# EAGLE board VC8E (EAGLE 6.6.0), part 1 of 2
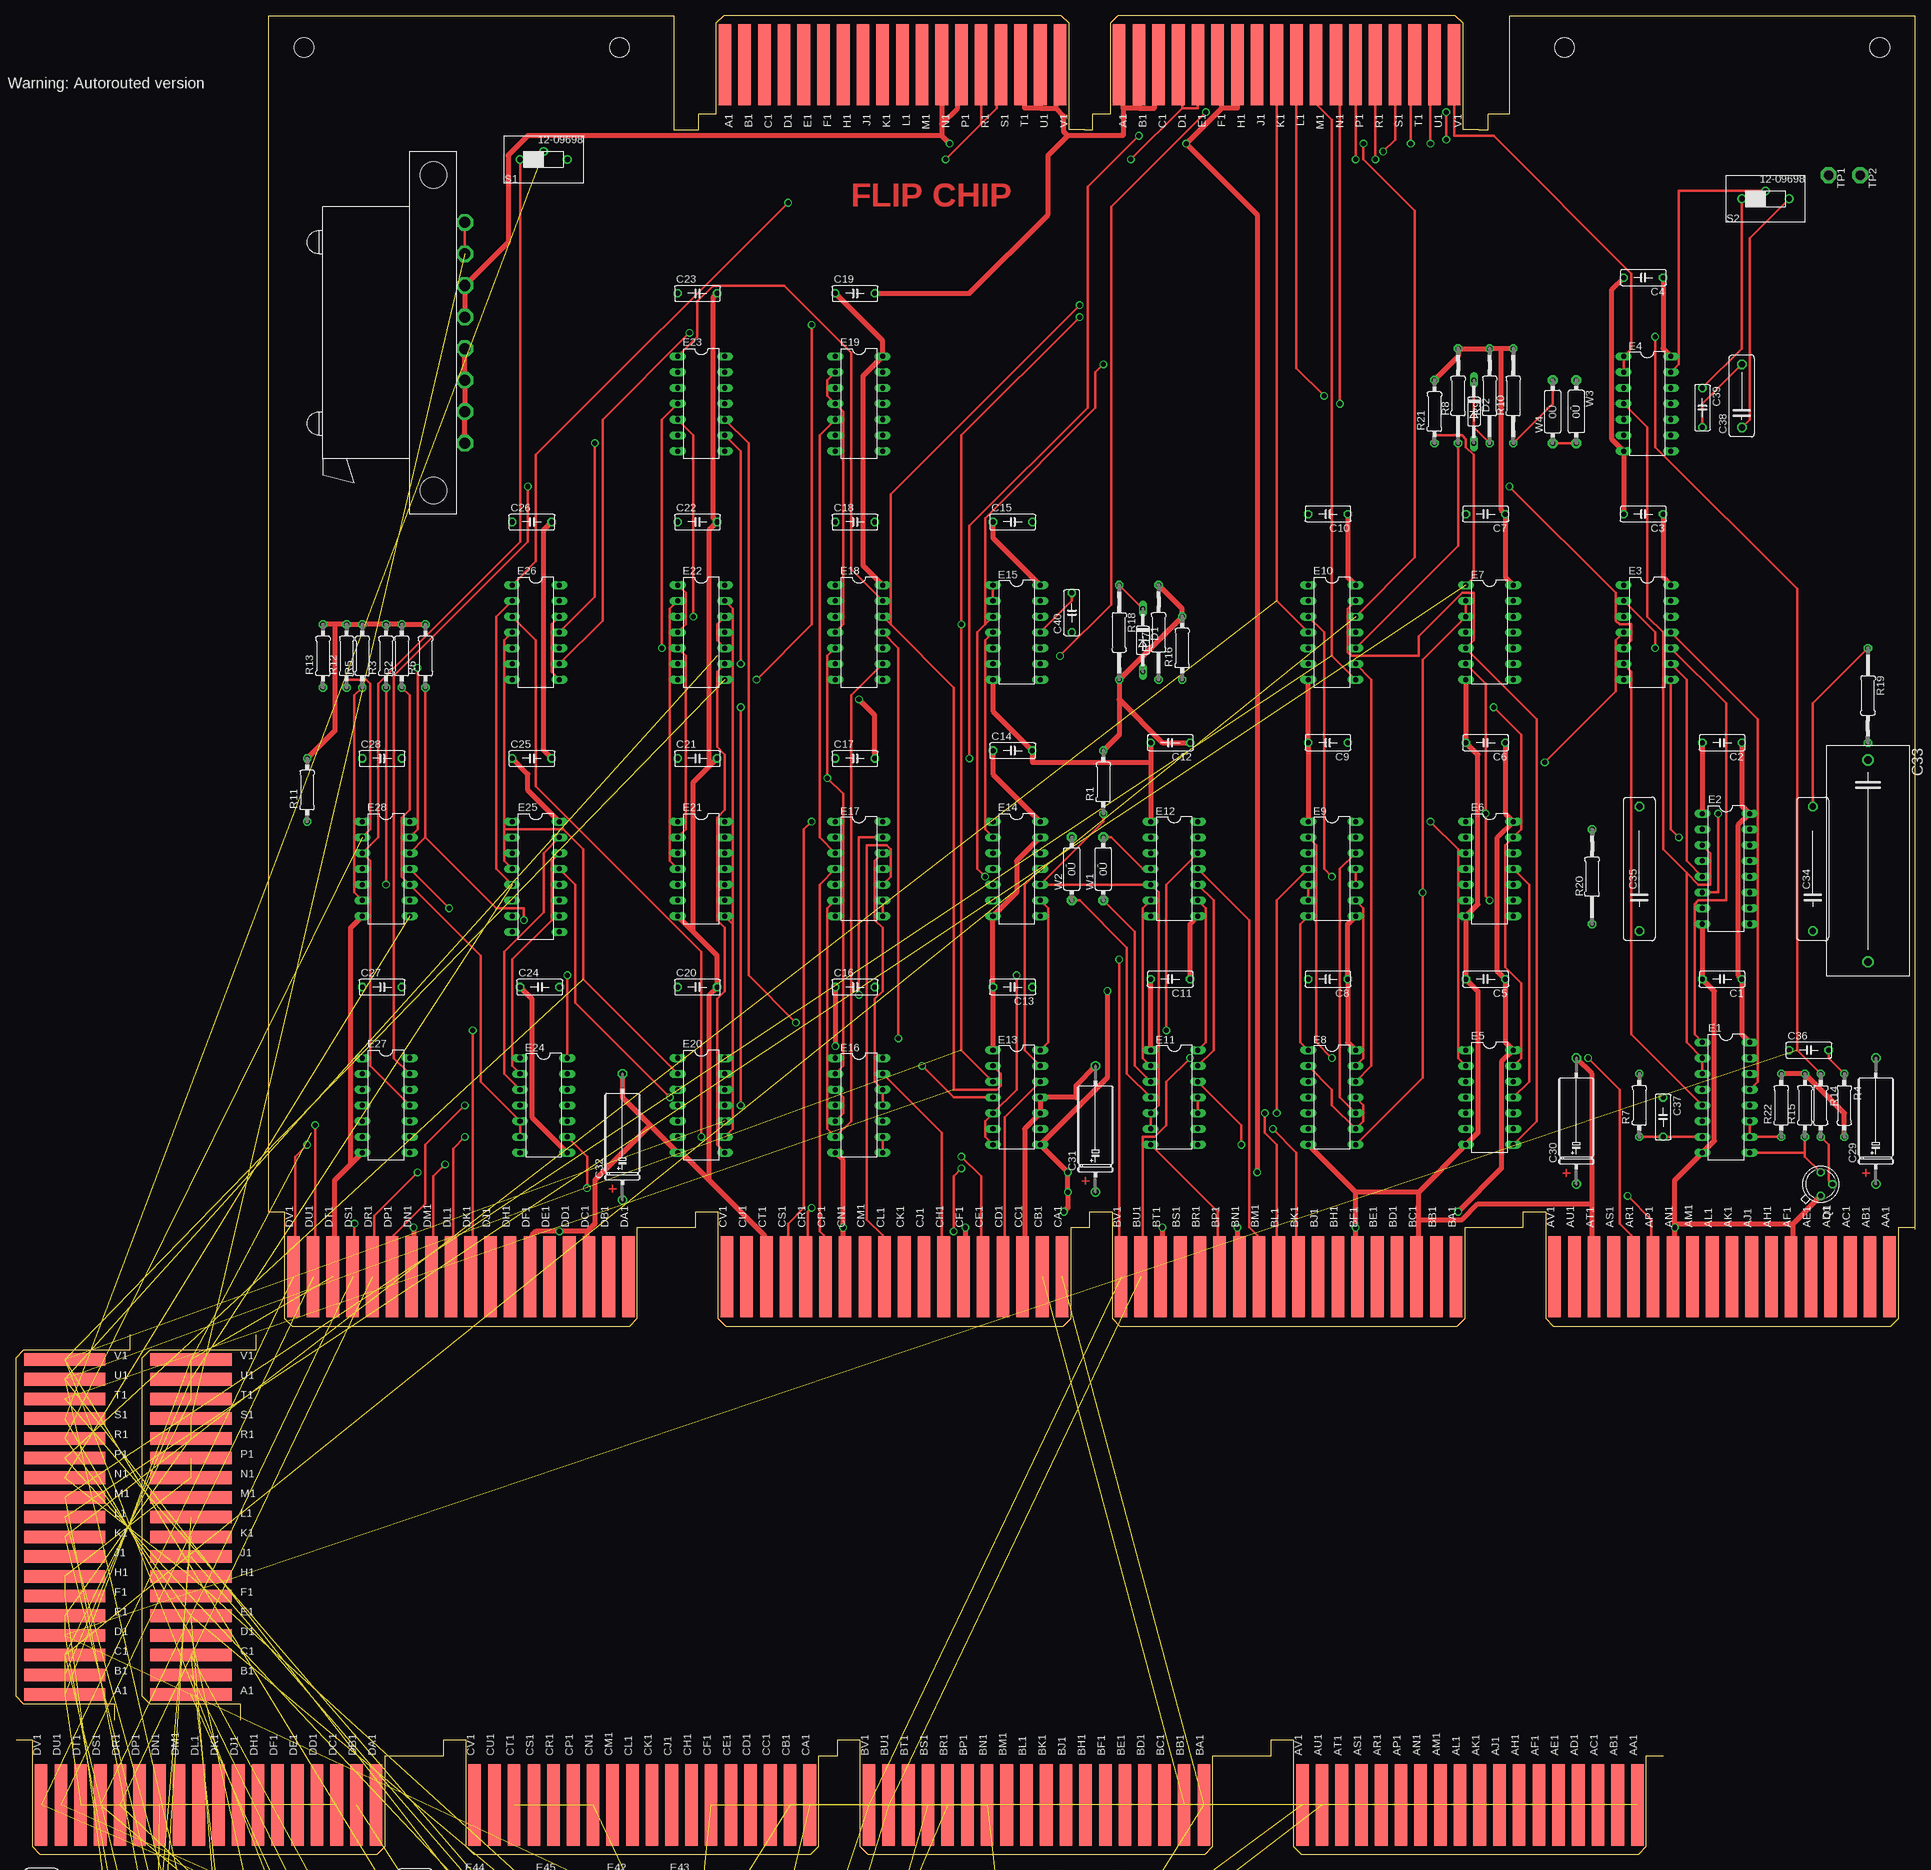
[diagram p3: board, top side]
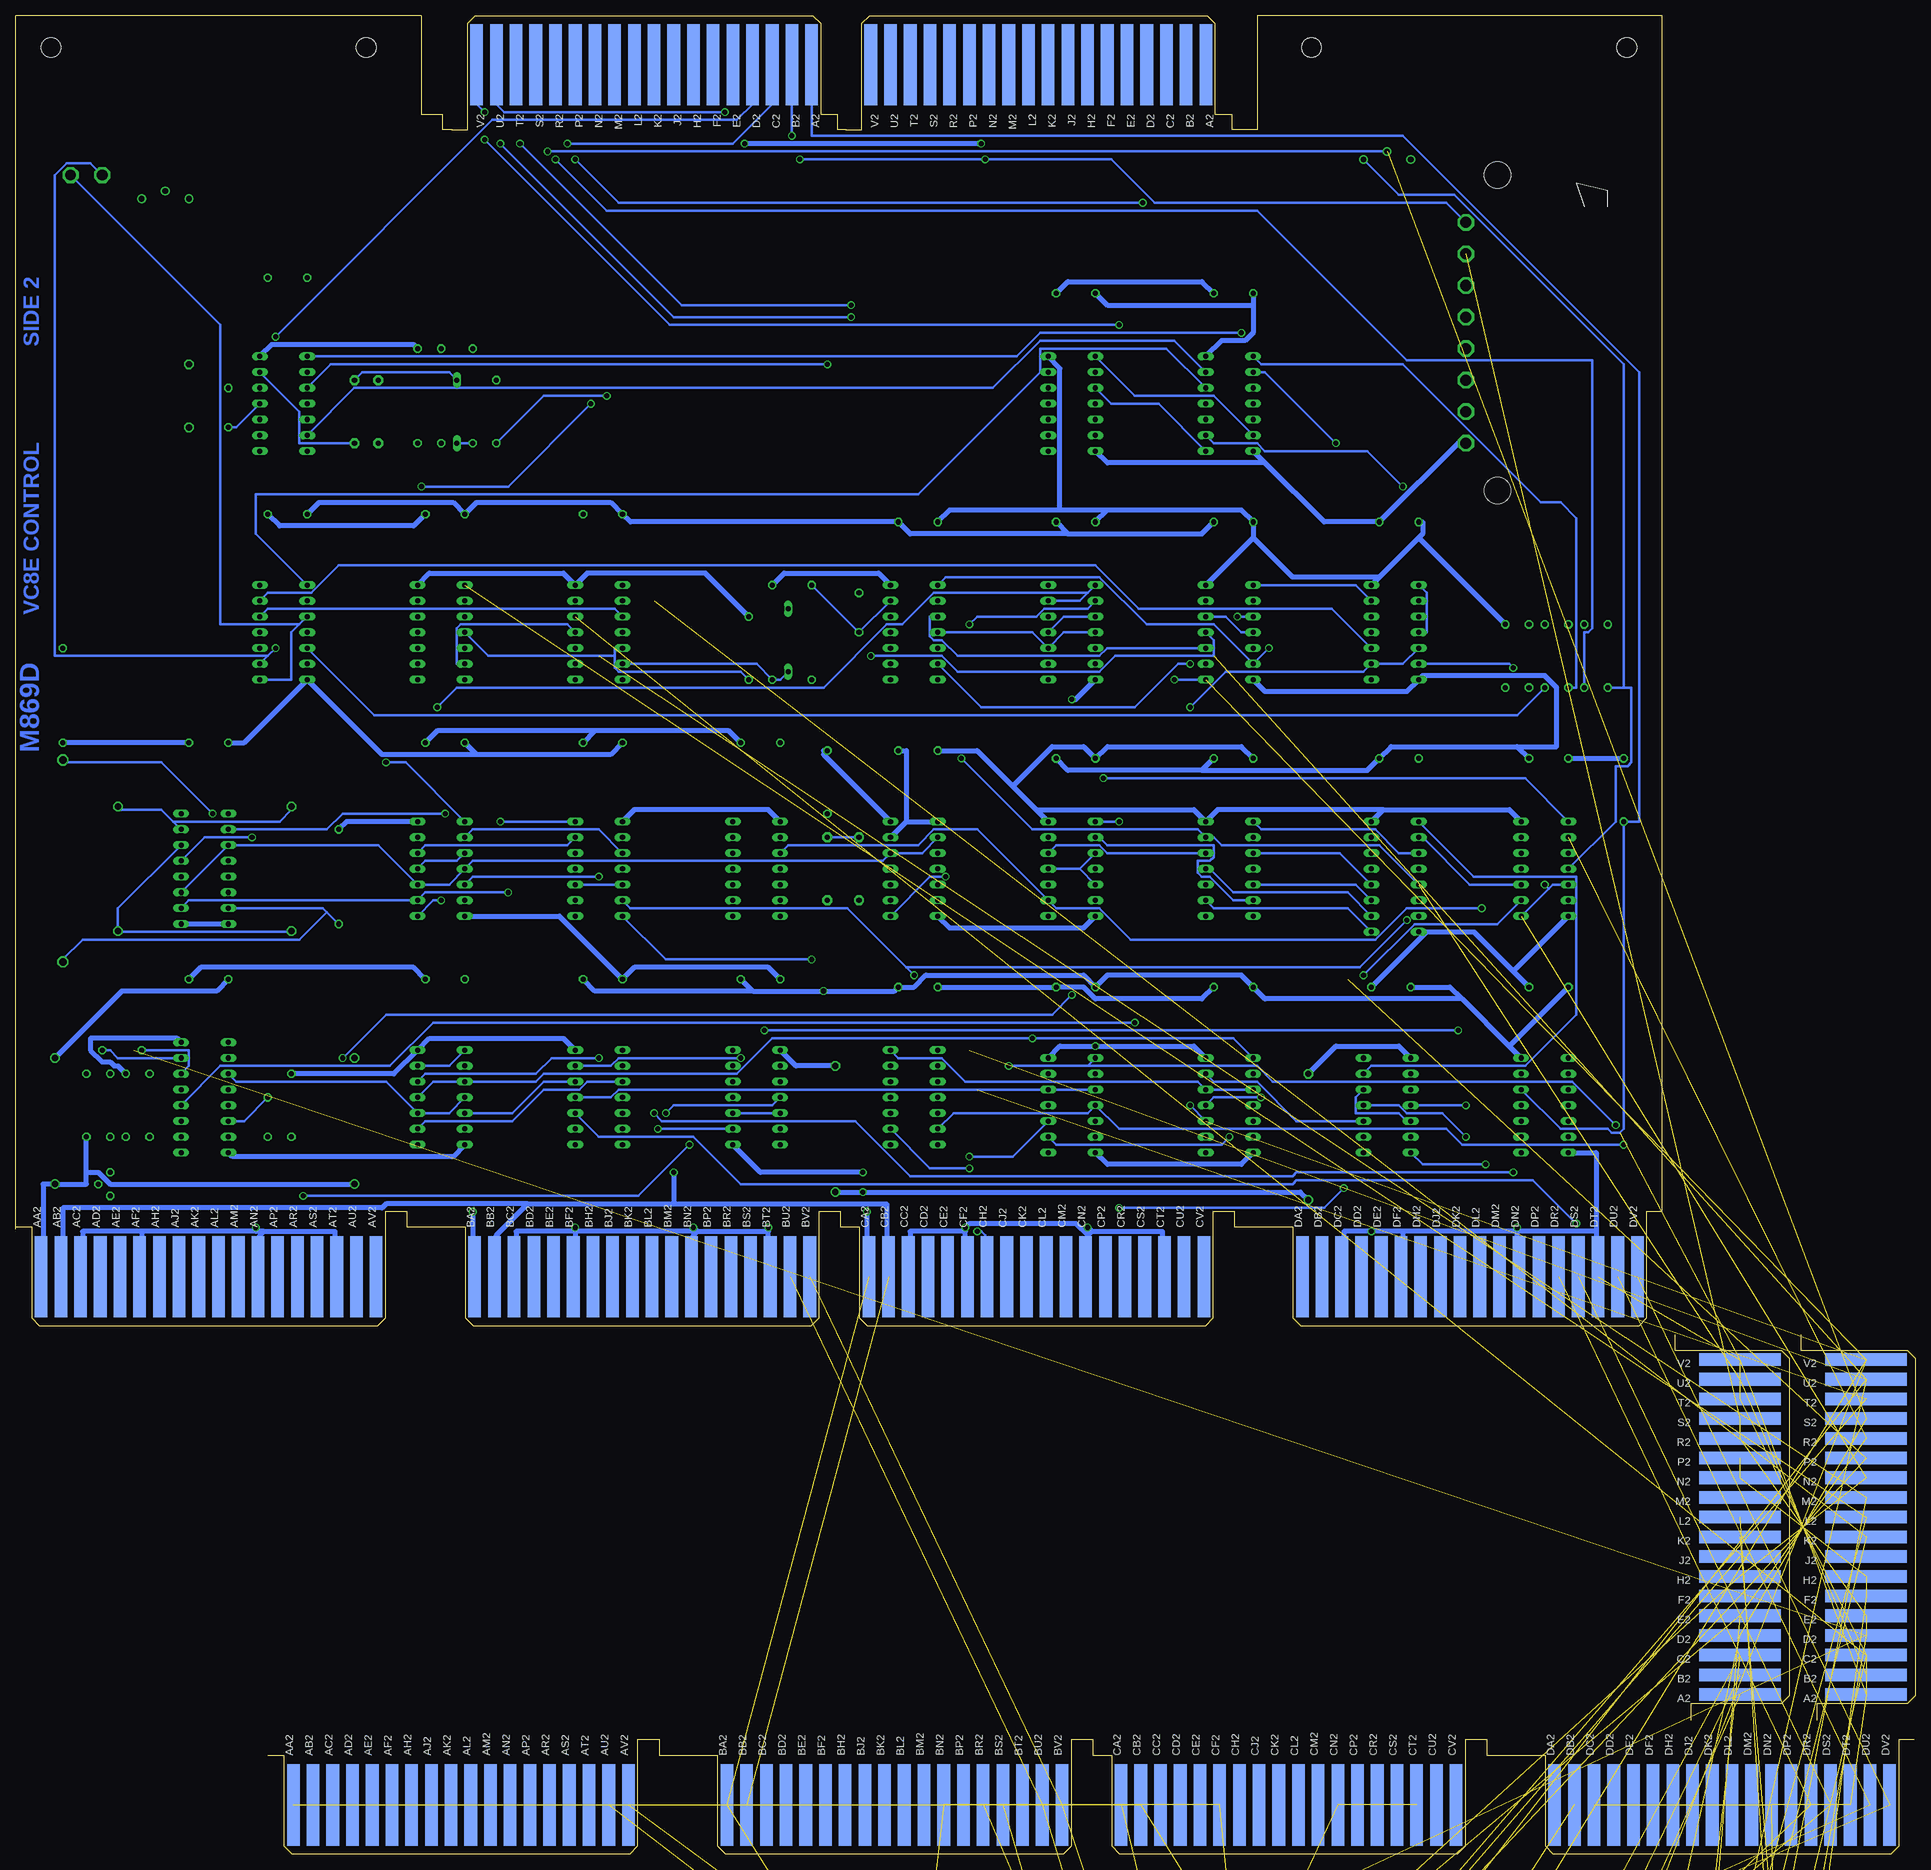
[diagram p4: board, bottom side, seen from below]

Size 306.07 x 296.23 mm. Coordinates in mm from the lower left corner, seen from the top.
Outline: 172.21,277.81 173.57,277.81 173.57,280.35 174.15,280.35
Outline: 306.07,100.65 306.07,296.23 240.67,296.23 240.67,280.35 237.24,280.35 237.24,277.81 235.71,277.81
Outline: 109.37,277.81 106.05,277.81 106.05,296.23 40.77,296.23 40.77,103.5
Outline: 110.65,280.35 110.07,280.35 110.07,277.81 109.22,277.81
Copper layers (1+2+15+16): Top 0.035mm / dielectric 1.5mm / ECO1 0.035mm / dielectric 0.15mm / ECO2 0.035mm / dielectric 0.2mm / Bottom 0.035mm
Design rules "16mils *": minimum track width 16mil, minimum drill 32mil, track to track 15mil, track to pad 10mil, pad to pad 10mil, via to via 10mil, smd to smd 10mil, copper to edge 13mil, drill to drill 10mil, minimum pad ring 10mil, minimum via ring 8mil, stop-mask expansion 0mil, vias tented up to drill 0mil, thermal gap 10mil
Net classes: 1 supply: width 0.813 mm
Holes 3.2 mm at 97.28,291.08 46.48,291.08 249.56,291.08 300.35,291.08

## Footprints (pad centres in the part's own frame; a part is rotated, then mirrored left to right if it is on the bottom)
C063-025X075 = drill 0.813 octagon: 1 -2.54,0; 2 3.81,0
E12-8 = drill 1.016: + -10.16,0 | drill 1.016 octagon: - 10.16,0
C325-137X374 = drill 1.194 octagon: 1 -16.256,0; 2 16.256,0
C203-054-229 = drill 1.016 octagon: 1 -10.033,0; 2 10.033,0
C102-043X133 = drill 1.016 octagon: 1 -5.08,0; 2 5.08,0
C150-054X183 = drill 1.016 octagon: 1 -7.493,0; 2 7.493,0
DO35-10 = drill 0.813 long: A 5.08,0; C -5.08,0
DO35Z10 = drill 0.813 long: A 5.08,0; C -5.08,0
DIL16 = drill 0.813 long: 1 -8.89,-3.81; 2 -6.35,-3.81; 3 -3.81,-3.81; 4 -1.27,-3.81; 5 1.27,-3.81; 6 3.81,-3.81; 7 6.35,-3.81; 8 8.89,-3.81; 9 8.89,3.81; 10 6.35,3.81; 11 3.81,3.81; 12 1.27,3.81; 13 -1.27,3.81; 14 -3.81,3.81; 15 -6.35,3.81; 16 -8.89,3.81
DIL14 = drill 0.813 long: 1 -7.62,-3.81; 2 -5.08,-3.81; 3 -2.54,-3.81; 4 0,-3.81; 5 2.54,-3.81; 6 5.08,-3.81; 7 7.62,-3.81; 8 7.62,3.81; 9 5.08,3.81; 10 2.54,3.81; 11 0,3.81; 12 -2.54,3.81; 13 -5.08,3.81; 14 -7.62,3.81
TO99 = drill 0.813 octagon: 1 -1.778,-1.778; 2 0,-2.54; 3 1.778,-1.778; 4 2.54,0; 5 1.778,1.778; 6 0,2.54; 7 -1.778,1.778; 8 -2.54,0
EDGE-CON2 = smd 13.106 x 2.032: A1 7.938,4.128; B1 7.938,7.303; C1 7.938,10.477; D1 7.938,13.652; E1 7.938,16.828; F1 7.938,20.003; H1 7.938,23.177; J1 7.938,26.352; K1 7.938,29.527; L1 7.938,32.703; M1 7.938,35.877; N1 7.938,39.053; P1 7.938,42.227; R1 7.938,45.403; S1 7.938,48.578; T1 7.938,51.752; U1 7.938,54.928; V1 7.938,58.102 | smd 13.106 x 2.032 bottom: A2 7.938,4.128; B2 7.938,7.303; C2 7.938,10.477; D2 7.938,13.652; E2 7.938,16.828; F2 7.938,20.003; H2 7.938,23.177; J2 7.938,26.352; K2 7.938,29.527; L2 7.938,32.703; M2 7.938,35.877; N2 7.938,39.053; P2 7.938,42.227; R2 7.938,45.403; S2 7.938,48.578; T2 7.938,51.752; U2 7.938,54.928; V2 7.938,58.102
1-480459-0 = drill 1.778 octagon: 1 46.99,-1.27; 2 41.91,-1.27; 3 36.83,-1.27; 4 31.75,-1.27; 5 26.67,-1.27; 6 21.59,-1.27; 7 16.51,-1.27; 8 11.43,-1.27 | hole 4.318: 3.81,3.81; 54.61,3.81
DEC40PINH = drill 0.914 octagon: A 24.13,1.27; AA -3.81,1.27; B 24.13,-1.27; BB -3.81,-1.27; C 21.59,1.27; CC -6.35,1.27; D 21.59,-1.27; DD -6.35,-1.27; E 19.05,1.27; EE -8.89,1.27; F 19.05,-1.27; FF -8.89,-1.27; H 16.51,1.27; HH -11.43,1.27; J 16.51,-1.27; JJ -11.43,-1.27; K 13.97,1.27; KK -13.97,1.27; L 13.97,-1.27; LL -13.97,-1.27; M 11.43,1.27; MM -16.51,1.27; N 11.43,-1.27; NN -16.51,-1.27; P 8.89,1.27; PP -19.05,1.27; R 8.89,-1.27; RR -19.05,-1.27; S 6.35,1.27; SS -21.59,1.27; T 6.35,-1.27; TT -21.59,-1.27; U 3.81,1.27; UU -24.13,1.27; V 3.81,-1.27; W 1.27,1.27; X 1.27,-1.27; Y -1.27,1.27; Z -1.27,-1.27 | drill 0.914: VV -24.13,-1.27
EDGE-CON8 = smd 2.032 x 13.106: AA1 261.303,7.938; AB1 258.127,7.938; AC1 254.952,7.938; AD1 251.778,7.938; AE1 248.602,7.938; AF1 245.428,7.938; AH1 242.252,7.938; AJ1 239.077,7.938; AK1 235.903,7.938; AL1 232.727,7.938; AM1 229.553,7.938; AN1 226.377,7.938; AP1 223.202,7.938; AR1 220.028,7.938; AS1 216.852,7.938; AT1 213.678,7.938; AU1 210.502,7.938; AV1 207.327,7.938; BA1 191.452,7.938; BB1 188.278,7.938; BC1 185.102,7.938; BD1 181.928,7.938; BE1 178.752,7.938; BF1 175.577,7.938; BH1 172.403,7.938; BJ1 169.227,7.938; BK1 166.053,7.938; BL1 162.877,7.938; BM1 159.702,7.938; BN1 156.528,7.938; BP1 153.352,7.938; BR1 150.178,7.938; BS1 147.002,7.938; BT1 143.827,7.938; BU1 140.653,7.938; BV1 137.477,7.938; CA1 127.953,7.938; CB1 124.778,7.938; CC1 121.603,7.938; CD1 118.427,7.938; CE1 115.252,7.938; CF1 112.078,7.938; CH1 108.903,7.938; CJ1 105.728,7.938; CK1 102.552,7.938; CL1 99.377,7.938; CM1 96.203,7.938; CN1 93.028,7.938; CP1 89.853,7.938; CR1 86.677,7.938; CS1 83.502,7.938; CT1 80.328,7.938; CU1 77.153,7.938; CV1 73.978,7.938; DA1 58.102,7.938; DB1 54.928,7.938; DC1 51.752,7.938; DD1 48.578,7.938; DE1 45.403,7.938; DF1 42.227,7.938; DH1 39.053,7.938; DJ1 35.877,7.938; DK1 32.703,7.938; DL1 29.527,7.938; DM1 26.352,7.938; DN1 23.177,7.938; DP1 20.003,7.938; DR1 16.828,7.938; DS1 13.652,7.938; DT1 10.477,7.938; DU1 7.303,7.938; DV1 4.128,7.938 | smd 2.032 x 13.106 bottom: AA2 261.303,7.938; AB2 258.127,7.938; AC2 254.952,7.938; AD2 251.778,7.938; AE2 248.602,7.938; AF2 245.428,7.938; AH2 242.252,7.938; AJ2 239.077,7.938; AK2 235.903,7.938; AL2 232.727,7.938; AM2 229.553,7.938; AN2 226.377,7.938; AP2 223.202,7.938; AR2 220.028,7.938; AS2 216.852,7.938; AT2 213.678,7.938; AU2 210.502,7.938; AV2 207.327,7.938; BA2 191.452,7.938; BB2 188.278,7.938; BC2 185.102,7.938; BD2 181.928,7.938; BE2 178.752,7.938; BF2 175.577,7.938; BH2 172.403,7.938; BJ2 169.227,7.938; BK2 166.053,7.938; BL2 162.877,7.938; BM2 159.702,7.938; BN2 156.528,7.938; BP2 153.352,7.938; BR2 150.178,7.938; BS2 147.002,7.938; BT2 143.827,7.938; BU2 140.653,7.938; BV2 137.477,7.938; CA2 127.953,7.938; CB2 124.778,7.938; CC2 121.603,7.938; CD2 118.427,7.938; CE2 115.252,7.938; CF2 112.078,7.938; CH2 108.903,7.938; CJ2 105.728,7.938; CK2 102.552,7.938; CL2 99.377,7.938; CM2 96.203,7.938; CN2 93.028,7.938; CP2 89.853,7.938; CR2 86.677,7.938; CS2 83.502,7.938; CT2 80.328,7.938; CU2 77.153,7.938; CV2 73.978,7.938; DA2 58.102,7.938; DB2 54.928,7.938; DC2 51.752,7.938; DD2 48.578,7.938; DE2 45.403,7.938; DF2 42.227,7.938; DH2 39.053,7.938; DJ2 35.877,7.938; DK2 32.703,7.938; DL2 29.527,7.938; DM2 26.352,7.938; DN2 23.177,7.938; DP2 20.003,7.938; DR2 16.828,7.938; DS2 13.652,7.938; DT2 10.477,7.938; DU2 7.303,7.938; DV2 4.128,7.938
TO18- = drill 0.813 octagon: 1 1.905,0; 2 0,1.905; 3 -1.905,0
TO5 = drill 0.813 octagon: 1 0,-2.54; 2 2.54,0; 3 0,2.54
0207/10 = drill 0.813 octagon: 1 -5.08,0; 2 5.08,0
0207/15 = drill 0.813 octagon: 1 -7.62,0; 2 7.62,0
S75P = drill 0.813 octagon: A -2.54,0; E 2.54,0; S 0,2.54
SP19L = drill 1.016 long: A 5.715,-1.27; E -6.985,-1.27; S -1.905,1.27
23-021 = drill 0.9: 1 -3.81,0; 2 0,1.27; 3 3.81,0
P1-17 = drill 1.702 pad 2.54 octagon: TP 0,0
0R/10 = drill 0.813 pad 1.6 octagon: 1 -5.08,0; 2 5.08,0

## Placement (x,y rotation side)
C1  .01uF  [C063-025X075]  275.59,140.97 180 top
C2  .01uF  [C063-025X075]  275.59,179.07 180 top
C3  .01uF  [C063-025X075]  262.89,215.9 180 top
C4  .01uF  [C063-025X075]  262.89,254 180 top
C5  .01uF  [C063-025X075]  237.49,140.97 180 top
C6  .01uF  [C063-025X075]  237.49,179.07 180 top
C7  .01uF  [C063-025X075]  237.49,215.9 180 top
C8  .01uF  [C063-025X075]  212.09,140.97 180 top
C9  .01uF  [C063-025X075]  212.09,179.07 180 top
C10  .01uF  [C063-025X075]  212.09,215.9 180 top
C11  .01uF  [C063-025X075]  186.69,140.97 180 top
C12  .01uF  [C063-025X075]  186.69,179.07 180 top
C13  .01uF  [C063-025X075]  161.29,139.7 180 top
C14  .01uF  [C063-025X075]  160.02,177.8 0 top
C15  .01uF  [C063-025X075]  160.02,214.63 0 top
C16  .01uF  [C063-025X075]  134.62,139.7 0 top
C17  .01uF  [C063-025X075]  134.62,176.53 0 top
C18  .01uF  [C063-025X075]  134.62,214.63 0 top
C19  .01uF  [C063-025X075]  134.62,251.46 0 top
C20  .01uF  [C063-025X075]  109.22,139.7 0 top
C21  .01uF  [C063-025X075]  109.22,176.53 0 top
C22  .01uF  [C063-025X075]  109.22,214.63 0 top
C23  .01uF  [C063-025X075]  109.22,251.46 0 top
C24  .01uF  [C063-025X075]  83.82,139.7 0 top
C25  .01uF  [C063-025X075]  82.55,176.53 0 top
C26  .01uF  [C063-025X075]  82.55,214.63 0 top
C27  .01uF  [C063-025X075]  58.42,139.7 0 top
C28  .01uF  [C063-025X075]  58.42,176.53 0 top
C29  6.8uF  [E12-8]  299.72,118.11 90 top
C30  6.8uF  [E12-8]  251.46,118.11 90 top
C31  6.8uF  [E12-8]  173.99,116.84 90 top
C32  6.8uF  [E12-8]  97.79,115.57 90 top
C33  .033uF  [C325-137X374]  298.45,160.02 270 top
C34  .022uF  [C203-054-229]  289.56,158.75 90 top
C35  .22uF  [C203-054-229]  261.62,158.75 90 top
C36  220pF  [C063-025X075]  288.29,129.54 0 top
C37  220pF  [C063-025X075]  265.43,119.38 270 top
C38  2700pF  [C102-043X133]  278.13,234.95 90 top
C39  .01uf 10%  [C063-025X075]  271.78,233.68 270 top
C40  470pF  [C063-025X075]  170.18,199.39 90 top
C41  .01uF  [C063-025X075]  58.42,-78.74 0 top  (outside the outline)
C42  .15uF  [C150-054X183]  133.35,-69.85 0 top  (outside the outline)
C43  .01uF  [C063-025X075]  67.31,-78.74 0 top  (outside the outline)
C44  .01uF  [C063-025X075]  76.2,-78.74 0 top  (outside the outline)
C45  .01uF  [C063-025X075]  85.09,-78.74 0 top  (outside the outline)
C46  .01uF  [C063-025X075]  93.98,-78.74 0 top  (outside the outline)
C47  .01uF  [C063-025X075]  102.87,-78.74 0 top  (outside the outline)
C48  .01uF  [C063-025X075]  111.76,-78.74 0 top  (outside the outline)
C49  .01uF  [C063-025X075]  120.65,-78.74 0 top  (outside the outline)
C50  .01uF  [C063-025X075]  129.54,-78.74 0 top  (outside the outline)
C51  .01uF  [C063-025X075]  138.43,-78.74 0 top  (outside the outline)
C52  .01uF  [C063-025X075]  147.32,-78.74 0 top  (outside the outline)
C53  .01uF  [C063-025X075]  156.21,-78.74 0 top  (outside the outline)
C54  .01uF  [C063-025X075]  165.1,-78.74 0 top  (outside the outline)
C55  6.8uF  [E12-8]  127,-38.1 0 top  (outside the outline)
C56  6.8uF  [E12-8]  149.86,-38.1 0 top  (outside the outline)
C57  6.8uF  [E12-8]  172.72,-38.1 0 top  (outside the outline)
C58  6.8uF  [E12-8]  10.16,-49.53 0 top  (outside the outline)
C59  6.8uF  [E12-8]  33.02,-49.53 0 top  (outside the outline)
C60  6.8uF  [E12-8]  55.88,-49.53 0 top  (outside the outline)
C61  6.8uF  [E12-8]  78.74,-49.53 0 top  (outside the outline)
C62  6.8uF  [E12-8]  101.6,-49.53 0 top  (outside the outline)
C63  10pF  [C063-025X075]  173.99,-78.74 0 top  (outside the outline)
C64  .01uF  [C063-025X075]  182.88,-78.74 0 top  (outside the outline)
C65  .01uF  [C063-025X075]  2.54,-86.36 0 top  (outside the outline)
C66  3300pF  [C150-054X183]  152.4,-69.85 0 top  (outside the outline)
C67  .15uF  [C150-054X183]  171.45,-69.85 0 top  (outside the outline)
C68  .15uF  [C150-054X183]  7.62,-80.01 0 top  (outside the outline)
C69  100pF  [C063-025X075]  11.43,-86.36 0 top  (outside the outline)
C70  47pF  [C063-025X075]  20.32,-86.36 0 top  (outside the outline)
C71  100pF  [C063-025X075]  29.21,-86.36 0 top  (outside the outline)
C72  3300pF  [C150-054X183]  26.67,-80.01 0 top  (outside the outline)
C73  .15uF  [C150-054X183]  45.72,-80.01 0 top  (outside the outline)
C74  47pF  [C063-025X075]  38.1,-86.36 0 top  (outside the outline)
C75  6.8uF  [E12-8]  124.46,-49.53 0 top  (outside the outline)
C76  6.8uF  [E12-8]  147.32,-49.53 0 top  (outside the outline)
C77  6.8uF  [E12-8]  170.18,-49.53 0 top  (outside the outline)
C78  6.8uF  [E12-8]  10.16,-59.69 0 top  (outside the outline)
D1  D664  [DO35-10]  181.61,195.58 270 top
D2  D664  [DO35-10]  234.95,232.41 270 top
D3  1N5711  [DO35-10]  49.53,-86.36 0 top  (outside the outline)
D4  FD777  [DO35-10]  62.23,-86.36 0 top  (outside the outline)
D5  FD777  [DO35-10]  74.93,-86.36 0 top  (outside the outline)
D6  1N5711  [DO35-10]  87.63,-86.36 0 top  (outside the outline)
D7  FD777  [DO35-10]  100.33,-86.36 0 top  (outside the outline)
D8  FD777  [DO35-10]  113.03,-86.36 0 top  (outside the outline)
D9  1N5711  [DO35-10]  125.73,-86.36 0 top  (outside the outline)
D10  1N5711  [DO35-10]  138.43,-86.36 0 top  (outside the outline)
D11  D664  [DO35-10]  151.13,-86.36 0 top  (outside the outline)
D12  D664  [DO35-10]  163.83,-86.36 0 top  (outside the outline)
D13  D664  [DO35-10]  176.53,-86.36 0 top  (outside the outline)
D14  D664  [DO35-10]  5.08,-92.71 0 top  (outside the outline)
D15  D664  [DO35-10]  17.78,-92.71 0 top  (outside the outline)
D16  D664  [DO35-10]  30.48,-92.71 0 top  (outside the outline)
D17  D664  [DO35-10]  43.18,-92.71 0 top  (outside the outline)
D18  D664  [DO35-10]  55.88,-92.71 0 top  (outside the outline)
D19  D664  [DO35-10]  68.58,-92.71 0 top  (outside the outline)
D20  D664  [DO35-10]  81.28,-92.71 0 top  (outside the outline)
D21  D664  [DO35-10]  93.98,-92.71 0 top  (outside the outline)
D22  D664  [DO35-10]  106.68,-92.71 0 top  (outside the outline)
D23  D664  [DO35-10]  119.38,-92.71 0 top  (outside the outline)
D24  D664  [DO35-10]  132.08,-92.71 0 top  (outside the outline)
D25  1N752A  [DO35Z10]  93.98,-105.41 0 top  (outside the outline)
D26  1N825  [DO35Z10]  106.68,-105.41 0 top  (outside the outline)
D27  D664  [DO35-10]  144.78,-92.71 0 top  (outside the outline)
D28  D664  [DO35-10]  157.48,-92.71 0 top  (outside the outline)
D29  1N752A  [DO35Z10]  119.38,-105.41 0 top  (outside the outline)
D30  1N5711  [DO35-10]  170.18,-92.71 0 top  (outside the outline)
D31  FD777  [DO35-10]  182.88,-92.71 0 top  (outside the outline)
D32  FD777  [DO35-10]  5.08,-99.06 0 top  (outside the outline)
D33  1N5711  [DO35-10]  17.78,-99.06 0 top  (outside the outline)
D34  FD777  [DO35-10]  30.48,-99.06 0 top  (outside the outline)
D35  FD777  [DO35-10]  43.18,-99.06 0 top  (outside the outline)
D36  1N5711  [DO35-10]  55.88,-99.06 0 top  (outside the outline)
D37  1N5711  [DO35-10]  68.58,-99.06 0 top  (outside the outline)
D38  D664  [DO35-10]  81.28,-99.06 0 top  (outside the outline)
D39  D664  [DO35-10]  93.98,-99.06 0 top  (outside the outline)
D40  D664  [DO35-10]  106.68,-99.06 0 top  (outside the outline)
D41  D664  [DO35-10]  119.38,-99.06 0 top  (outside the outline)
D42  D664  [DO35-10]  132.08,-99.06 0 top  (outside the outline)
D43  D664  [DO35-10]  144.78,-99.06 0 top  (outside the outline)
D44  D664  [DO35-10]  157.48,-99.06 0 top  (outside the outline)
D45  D664  [DO35-10]  170.18,-99.06 0 top  (outside the outline)
D46  D664  [DO35-10]  182.88,-99.06 0 top  (outside the outline)
D47  D664  [DO35-10]  5.08,-105.41 0 top  (outside the outline)
D48  D664  [DO35-10]  17.78,-105.41 0 top  (outside the outline)
D49  D664  [DO35-10]  30.48,-105.41 0 top  (outside the outline)
D50  D664  [DO35-10]  43.18,-105.41 0 top  (outside the outline)
D51  D664  [DO35-10]  55.88,-105.41 0 top  (outside the outline)
D52  D664  [DO35-10]  68.58,-105.41 0 top  (outside the outline)
D53  D664  [DO35-10]  81.28,-105.41 0 top  (outside the outline)
D54  1N752A  [DO35Z10]  132.08,-105.41 0 top  (outside the outline)
D55  1N752A  [DO35Z10]  144.78,-105.41 0 top  (outside the outline)
D56  1N752A  [DO35Z10]  157.48,-105.41 0 top  (outside the outline)
D57  1N752A  [DO35Z10]  170.18,-105.41 0 top  (outside the outline)
D58  1N825  [DO35Z10]  182.88,-105.41 0 top  (outside the outline)
D59  1N825  [DO35Z10]  5.08,-111.76 0 top  (outside the outline)
E1  74123N  [DIL16]  275.59,121.92 270 top
E2  74123N  [DIL16]  275.59,158.75 270 top
E3  7402N  [DIL14]  262.89,196.85 270 top
E4  9601  [DIL14]  262.89,233.68 270 top
E5  7474N  [DIL14]  237.49,121.92 270 top
E6  7474N  [DIL14]  237.49,158.75 270 top
E7  N8881N  [DIL14]  237.49,196.85 270 top
E8  N8881N  [DIL14]  212.09,121.92 270 top
E9  SP380N  [DIL14]  212.09,158.75 270 top
E10  7406N  [DIL14]  212.09,196.85 270 top
E11  SP380N  [DIL14]  186.69,121.92 270 top
E12  SP314N  [DIL14]  186.69,158.75 270 top
E13  SP380N  [DIL14]  161.29,121.92 270 top
E14  7404N  [DIL14]  161.29,158.75 270 top
E15  9601  [DIL14]  161.29,196.85 270 top
E16  N8881N  [DIL14]  135.89,120.65 270 top
E17  N8881N  [DIL14]  135.89,158.75 270 top
E18  7474N  [DIL14]  135.89,196.85 270 top
E19  7474N  [DIL14]  135.89,233.68 270 top
E20  7402N  [DIL14]  110.49,120.65 270 top
E21  7404N  [DIL14]  110.49,158.75 270 top
E22  7400N  [DIL14]  110.49,196.85 270 top
E23  74H21N  [DIL14]  110.49,233.68 270 top
E24  SP380N  [DIL14]  85.09,120.65 270 top
E25  DEC8251  [DIL16]  83.82,157.48 270 top
E26  7400N  [DIL14]  83.82,196.85 270 top
E27  7400N  [DIL14]  59.69,120.65 270 top
E28  7416N  [DIL14]  59.69,158.75 270 top
E29  7404N  [DIL14]  55.88,-69.85 0 top  (outside the outline)
E30  7404N  [DIL14]  76.2,-69.85 0 top  (outside the outline)
E31  SP380N  [DIL14]  96.52,-69.85 0 top  (outside the outline)
E32  SP380N  [DIL14]  115.57,-69.85 0 top  (outside the outline)
E33  74193N  [DIL16]  34.29,-59.69 0 top  (outside the outline)
E34  74193N  [DIL16]  57.15,-59.69 0 top  (outside the outline)
E35  74193N  [DIL16]  80.01,-59.69 0 top  (outside the outline)
E36  74193N  [DIL16]  102.87,-59.69 0 top  (outside the outline)
E37  74193N  [DIL16]  125.73,-59.69 0 top  (outside the outline)
E38  74193N  [DIL16]  148.59,-59.69 0 top  (outside the outline)
E39  DEC8235  [DIL16]  171.45,-59.69 0 top  (outside the outline)
E40  DEC8235  [DIL16]  11.43,-69.85 0 top  (outside the outline)
E41  DEC8235  [DIL16]  34.29,-69.85 0 top  (outside the outline)
E42  LM302  [TO99]  97.79,-7.62 0 top  (outside the outline)
E43  LM302  [TO99]  107.95,-7.62 0 top  (outside the outline)
E44  MC1439  [TO99]  74.93,-7.62 0 top  (outside the outline)
E45  MC1439  [TO99]  86.36,-7.62 0 top  (outside the outline)
F  EDGE-TOP  [EDGE-CON2]  173.67,296.23 270 top
F1  EDGE-TOP  [EDGE-CON2]  0,21.59 0 top
H  EDGE-TOP  [EDGE-CON2]  110.17,296.23 270 top
H1  EDGE-TOP  [EDGE-CON2]  20.32,21.59 0 top
J1  1-480459-0  [1-480459-0]  71.12,215.9 90 top
J2  [DEC40PINH]  34.29,-17.78 0 top  (outside the outline)
OMNIBUS  QUAD  [EDGE-CON8]  40.64,85.09 0 top
OMNIBUS1  QUAD  [EDGE-CON8]  0,0 0 top
Q1  2N3009  [TO18-]  290.83,107.95 270 top
Q2  2N3009  [TO5]  158.75,-8.89 0 top  (outside the outline)
Q3  2N3009  [TO5]  168.91,-8.89 0 top  (outside the outline)
Q4  2N3009  [TO5]  179.07,-8.89 0 top  (outside the outline)
Q5  2N3009  [TO5]  3.81,-27.94 0 top  (outside the outline)
Q6  2N3009  [TO5]  13.97,-27.94 0 top  (outside the outline)
Q7  2N3009  [TO5]  24.13,-27.94 0 top  (outside the outline)
Q8  2N3009  [TO5]  34.29,-27.94 0 top  (outside the outline)
Q9  2N3009  [TO5]  44.45,-27.94 0 top  (outside the outline)
Q10  2N3009  [TO5]  54.61,-27.94 0 top  (outside the outline)
Q11  2N3009  [TO5]  64.77,-27.94 0 top  (outside the outline)
Q12  MPS6534  [TO5]  118.11,-8.89 0 top  (outside the outline)
Q13  2N3009  [TO5]  74.93,-27.94 0 top  (outside the outline)
Q14  MPS6534  [TO5]  128.27,-8.89 0 top  (outside the outline)
Q15  2N2219  [TO5]  85.09,-27.94 0 top  (outside the outline)
Q16  MPS6534  [TO5]  138.43,-8.89 0 top  (outside the outline)
Q17  2N2219  [TO5]  95.25,-27.94 0 top  (outside the outline)
Q18  2N2219  [TO5]  105.41,-27.94 0 top  (outside the outline)
Q19  2N3009  [TO5]  115.57,-27.94 0 top  (outside the outline)
Q20  2N3009  [TO5]  125.73,-27.94 0 top  (outside the outline)
Q21  2N3009  [TO5]  135.89,-27.94 0 top  (outside the outline)
Q22  2N3009  [TO5]  146.05,-27.94 0 top  (outside the outline)
Q23  2N3009  [TO5]  156.21,-27.94 0 top  (outside the outline)
Q24  2N3009  [TO5]  166.37,-27.94 0 top  (outside the outline)
Q25  2N3009  [TO5]  176.53,-27.94 0 top  (outside the outline)
Q26  2N3009  [TO5]  186.69,-27.94 0 top  (outside the outline)
Q27  2N3009  [TO5]  3.81,-39.37 0 top  (outside the outline)
Q28  2N3009  [TO5]  13.97,-39.37 0 top  (outside the outline)
Q29  2N2219  [TO5]  24.13,-39.37 0 top  (outside the outline)
Q30  MPS6534  [TO5]  148.59,-8.89 0 top  (outside the outline)
Q31  2N4313  [TO5]  34.29,-39.37 0 top  (outside the outline)
R1  1.5K  [0207/10]  175.26,172.72 90 top
R2  470  [0207/10]  62.23,193.04 90 top
R3  470  [0207/10]  59.69,193.04 90 top
R4  10K  [0207/10]  294.64,120.65 270 top
R5  470  [0207/10]  55.88,193.04 90 top
R6  470  [0207/10]  66.04,193.04 90 top
R7  10K  [0207/10]  261.62,120.65 90 top
R8  19.6K 1%  [0207/15]  232.41,234.95 90 top
R9  6.81K 1%  [0207/15]  237.49,234.95 90 top
R10  33.2K 1%  [0207/15]  241.3,234.95 90 top
R11  1.5K  [0207/10]  46.99,171.45 90 top
R12  470  [0207/10]  53.34,193.04 90 top
R13  470  [0207/10]  49.53,193.04 90 top
R14  1K  [0207/10]  290.83,120.65 270 top
R15  1K  [0207/10]  288.29,120.65 90 top
R16  1K  [0207/10]  187.96,194.31 90 top
R17  12.1K 1%  [0207/15]  184.15,196.85 90 top
R18  39.2K 1%  [0207/15]  177.8,196.85 270 top
R19  24.3K 1%  [0207/15]  298.45,186.69 270 top
R20  31.6K 1%  [0207/15]  254,157.48 90 top
R21  470  [0207/10]  228.6,232.41 90 top
R22  1K  [0207/10]  284.48,120.65 90 top
R23  1K  [0207/10]  129.54,-113.03 0 top  (outside the outline)
R24  1K  [0207/10]  142.24,-113.03 0 top  (outside the outline)
R25  1K  [0207/10]  154.94,-113.03 0 top  (outside the outline)
R26  1K  [0207/10]  167.64,-113.03 0 top  (outside the outline)
R27  1K  [0207/10]  180.34,-113.03 0 top  (outside the outline)
R28  1K  [0207/10]  5.08,-118.11 0 top  (outside the outline)
R29  1K  [0207/10]  17.78,-118.11 0 top  (outside the outline)
R30  3.3K  [0207/10]  30.48,-118.11 0 top  (outside the outline)
R31  3.3K  [0207/10]  43.18,-118.11 0 top  (outside the outline)
R32  2.2K  [0207/10]  55.88,-118.11 0 top  (outside the outline)
R33  511K  [0207/15]  7.62,-143.51 0 top  (outside the outline)
R34  511K  [0207/15]  25.4,-143.51 0 top  (outside the outline)
R35  3.3K  [0207/10]  68.58,-118.11 0 top  (outside the outline)
R36  3.3K  [0207/10]  81.28,-118.11 0 top  (outside the outline)
R37  2.2K  [0207/10]  93.98,-118.11 0 top  (outside the outline)
R38  243K  [0207/15]  43.18,-143.51 0 top  (outside the outline)
R39  256K  [0207/15]  60.96,-143.51 0 top  (outside the outline)
R40  3.3K  [0207/10]  106.68,-118.11 0 top  (outside the outline)
R41  121K  [0207/15]  78.74,-143.51 0 top  (outside the outline)
R42  128K  [0207/15]  96.52,-143.51 0 top  (outside the outline)
R43  3.3K  [0207/10]  119.38,-118.11 0 top  (outside the outline)
R44  68.1K  [0207/15]  114.3,-143.51 0 top  (outside the outline)
R45  64K  [0207/15]  132.08,-143.51 0 top  (outside the outline)
R46  3.3K  [0207/10]  132.08,-118.11 0 top  (outside the outline)
R47  31.6K  [0207/15]  149.86,-143.51 0 top  (outside the outline)
R48  32K  [0207/15]  167.64,-143.51 0 top  (outside the outline)
R49  3.3K  [0207/10]  144.78,-118.11 0 top  (outside the outline)
R50  14.7K  [0207/15]  7.62,-148.59 0 top  (outside the outline)
R51  7.985K  [0207/15]  25.4,-148.59 0 top  (outside the outline)
R52  3.3K  [0207/10]  157.48,-118.11 0 top  (outside the outline)
R53  8.25K  [0207/15]  43.18,-148.59 0 top  (outside the outline)
R54  7.985K  [0207/15]  60.96,-148.59 0 top  (outside the outline)
R55  3.3K  [0207/10]  170.18,-118.11 0 top  (outside the outline)
R56  3.83K  [0207/15]  78.74,-148.59 0 top  (outside the outline)
R57  3.987K  [0207/15]  96.52,-148.59 0 top  (outside the outline)
R58  3.3K  [0207/10]  182.88,-118.11 0 top  (outside the outline)
R59  1.96K  [0207/15]  114.3,-148.59 0 top  (outside the outline)
R60  1.992K  [0207/15]  132.08,-148.59 0 top  (outside the outline)
R61  3.3K  [0207/10]  5.08,-123.19 0 top  (outside the outline)
R62  1K  [0207/15]  149.86,-148.59 0 top  (outside the outline)
R63  200K  [0207/15]  167.64,-148.59 0 top  (outside the outline)
R64  7.985K  [0207/15]  7.62,-153.67 0 top  (outside the outline)
R65  500  [S75P]  43.18,-38.1 0 top  (outside the outline)
R66  100  [S75P]  50.8,-38.1 0 top  (outside the outline)
R67  50  [S75P]  58.42,-38.1 0 top  (outside the outline)
R68  50  [S75P]  66.04,-38.1 0 top  (outside the outline)
R69  20  [S75P]  73.66,-38.1 0 top  (outside the outline)
R70  1K  [0207/15]  25.4,-153.67 0 top  (outside the outline)
R71  3.9K  [0207/10]  17.78,-123.19 0 top  (outside the outline)
R72  390  [0207/10]  30.48,-123.19 0 top  (outside the outline)
R73  2K  [SP19L]  26.67,-111.76 0 top  (outside the outline)
R74  2K  [SP19L]  50.8,-111.76 0 top  (outside the outline)
R75  3.16K  [0207/15]  43.18,-153.67 0 top  (outside the outline)
R76  390  [0207/10]  43.18,-123.19 0 top  (outside the outline)
R77  390  [0207/10]  55.88,-123.19 0 top  (outside the outline)
R78  470  [0207/10]  68.58,-123.19 0 top  (outside the outline)
R79  2.2K  [0207/10]  81.28,-123.19 0 top  (outside the outline)
R80  1.2K  [0207/10]  93.98,-123.19 0 top  (outside the outline)
R81  6.8K  [0207/10]  106.68,-123.19 0 top  (outside the outline)
R82  100  [0207/10]  119.38,-123.19 0 top  (outside the outline)
R83  390  [0207/10]  132.08,-123.19 0 top  (outside the outline)
R84  2.2K  [0207/10]  144.78,-123.19 0 top  (outside the outline)
R85  390  [0207/10]  157.48,-123.19 0 top  (outside the outline)
R86  2.2K  [0207/10]  170.18,-123.19 0 top  (outside the outline)
R87  47  [0207/10]  182.88,-123.19 0 top  (outside the outline)
R88  4.7K  [0207/10]  5.08,-128.27 0 top  (outside the outline)
R89  390  [0207/10]  17.78,-128.27 0 top  (outside the outline)
R90  18  [0207/10]  30.48,-128.27 0 top  (outside the outline)
R91  390  [0207/10]  43.18,-128.27 0 top  (outside the outline)
R92  18  [0207/10]  55.88,-128.27 0 top  (outside the outline)
R93  1K 1%  [0207/15]  60.96,-153.67 0 top  (outside the outline)
R94  10K  [0207/10]  68.58,-128.27 0 top  (outside the outline)
R95  3.3K  [0207/10]  81.28,-128.27 0 top  (outside the outline)
R96  3.3K  [0207/10]  93.98,-128.27 0 top  (outside the outline)
R97  2.2K  [0207/10]  106.68,-128.27 0 top  (outside the outline)
R98  511K  [0207/15]  78.74,-153.67 0 top  (outside the outline)
R99  511K  [0207/15]  96.52,-153.67 0 top  (outside the outline)
R100  3.3K  [0207/10]  119.38,-128.27 0 top  (outside the outline)
R101  3.3K  [0207/10]  132.08,-128.27 0 top  (outside the outline)
R102  2.2K  [0207/10]  144.78,-128.27 0 top  (outside the outline)
R103  243K  [0207/15]  114.3,-153.67 0 top  (outside the outline)
R104  256K  [0207/15]  132.08,-153.67 0 top  (outside the outline)
R105  3.3K  [0207/10]  157.48,-128.27 0 top  (outside the outline)
R106  121K  [0207/15]  149.86,-153.67 0 top  (outside the outline)
R107  128K  [0207/15]  167.64,-153.67 0 top  (outside the outline)
R108  3.3K  [0207/10]  170.18,-128.27 0 top  (outside the outline)
R109  68.1K  [0207/15]  7.62,-158.75 0 top  (outside the outline)
R110  64K  [0207/15]  25.4,-158.75 0 top  (outside the outline)
R111  3.3K  [0207/10]  182.88,-128.27 0 top  (outside the outline)
R112  31.6K  [0207/15]  43.18,-158.75 0 top  (outside the outline)
R113  32K  [0207/15]  60.96,-158.75 0 top  (outside the outline)
R114  3.3K  [0207/10]  5.08,-133.35 0 top  (outside the outline)
R115  14.7K  [0207/15]  78.74,-158.75 0 top  (outside the outline)
R116  500  [S75P]  81.28,-38.1 0 top  (outside the outline)
R117  7.985K  [0207/15]  96.52,-158.75 0 top  (outside the outline)
R118  7.985K  [0207/15]  114.3,-158.75 0 top  (outside the outline)
R119  3.3K  [0207/10]  17.78,-133.35 0 top  (outside the outline)
R120  8.25K  [0207/15]  132.08,-158.75 0 top  (outside the outline)
R121  100  [S75P]  88.9,-38.1 0 top  (outside the outline)
R122  7.985K  [0207/15]  149.86,-158.75 0 top  (outside the outline)
R123  3.3K  [0207/10]  30.48,-133.35 0 top  (outside the outline)
R124  3.83K  [0207/15]  167.64,-158.75 0 top  (outside the outline)
R125  50  [S75P]  96.52,-38.1 0 top  (outside the outline)
R126  3.987K  [0207/15]  7.62,-163.83 0 top  (outside the outline)
R127  3.3K  [0207/10]  43.18,-133.35 0 top  (outside the outline)
R128  1.96K  [0207/15]  25.4,-163.83 0 top  (outside the outline)
R129  50  [S75P]  104.14,-38.1 0 top  (outside the outline)
R130  1.992K  [0207/15]  43.18,-163.83 0 top  (outside the outline)
R131  3.3K  [0207/10]  55.88,-133.35 0 top  (outside the outline)
R132  1K  [0207/15]  60.96,-163.83 0 top  (outside the outline)
R133  20  [S75P]  111.76,-38.1 0 top  (outside the outline)
R134  200K  [0207/15]  78.74,-163.83 0 top  (outside the outline)
R135  1K  [0207/15]  96.52,-163.83 0 top  (outside the outline)
R136  47  [0207/10]  68.58,-133.35 0 top  (outside the outline)
R137  18  [0207/10]  81.28,-133.35 0 top  (outside the outline)
R138  4.7K  [0207/10]  93.98,-133.35 0 top  (outside the outline)
R139  390  [0207/10]  106.68,-133.35 0 top  (outside the outline)
R140  18  [0207/10]  119.38,-133.35 0 top  (outside the outline)
R141  1.96K 1%  [0207/15]  114.3,-163.83 0 top  (outside the outline)
R142  8.25K  [0207/15]  132.08,-163.83 0 top  (outside the outline)
R143  133  [0207/15]  149.86,-163.83 0 top  (outside the outline)
R144  866 1%  [0207/15]  167.64,-163.83 0 top  (outside the outline)
R145  1K 1%  [0207/15]  7.62,-168.91 0 top  (outside the outline)
R146  3.9K  [0207/10]  132.08,-133.35 0 top  (outside the outline)
R147  390  [0207/10]  144.78,-133.35 0 top  (outside the outline)
R148  390  [0207/10]  157.48,-133.35 0 top  (outside the outline)
R149  1K 1%  [0207/15]  25.4,-168.91 0 top  (outside the outline)
R150  1.96K 1%  [0207/15]  43.18,-168.91 0 top  (outside the outline)
R151  8.25K 1%  [0207/10]  115.57,-113.03 0 top  (outside the outline)
R152  500  [SP19L]  74.93,-111.76 0 top  (outside the outline)
R153  500  [SP19L]  99.06,-111.76 0 top  (outside the outline)
R154  866 1%  [0207/15]  60.96,-168.91 0 top  (outside the outline)
R155  133  [0207/15]  78.74,-168.91 0 top  (outside the outline)
R156  18  [0207/10]  170.18,-133.35 0 top  (outside the outline)
R157  18  [0207/10]  182.88,-133.35 0 top  (outside the outline)
R158  18  [0207/10]  5.08,-138.43 0 top  (outside the outline)
R159  4.7K  [0207/10]  17.78,-138.43 0 top  (outside the outline)
R160  390  [0207/10]  30.48,-138.43 0 top  (outside the outline)
R161  4.7K  [0207/10]  43.18,-138.43 0 top  (outside the outline)
R162  390  [0207/10]  55.88,-138.43 0 top  (outside the outline)
R163  18  [0207/10]  68.58,-138.43 0 top  (outside the outline)
R164  390  [0207/10]  81.28,-138.43 0 top  (outside the outline)
R165  1K 1%  [0207/15]  96.52,-168.91 0 top  (outside the outline)
R166  10K  [0207/10]  93.98,-138.43 0 top  (outside the outline)
R167  47  [0207/10]  106.68,-138.43 0 top  (outside the outline)
S1  12-09698  [23-021]  85.09,273.05 0 top
S2  12-09698  [23-021]  281.94,266.7 0 top
TP1  TPSQPAD1-17  [P1-17]  292.1,270.51 270 top
TP2  TPSQPAD1-17  [P1-17]  297.18,270.51 270 top
W1  0  [0R/10]  175.26,158.75 90 top
W2  open  [0R/10]  170.18,158.75 90 top
W3  0  [0R/10]  251.46,232.41 270 top
W4  open  [0R/10]  247.65,232.41 90 top
W5  0  [0207/10]  119.38,-138.43 0 top  (outside the outline)
W6  open  [0207/10]  132.08,-138.43 0 top  (outside the outline)
W7  open  [0207/10]  144.78,-138.43 0 top  (outside the outline)
W8  OPEN  [0207/10]  157.48,-138.43 0 top  (outside the outline)
W9  OPEN  [0207/10]  170.18,-138.43 0 top  (outside the outline)
W10  OPEN  [0207/10]  182.88,-138.43 0 top  (outside the outline)